# Altium schematic sheet ADC.SchDoc
size A4
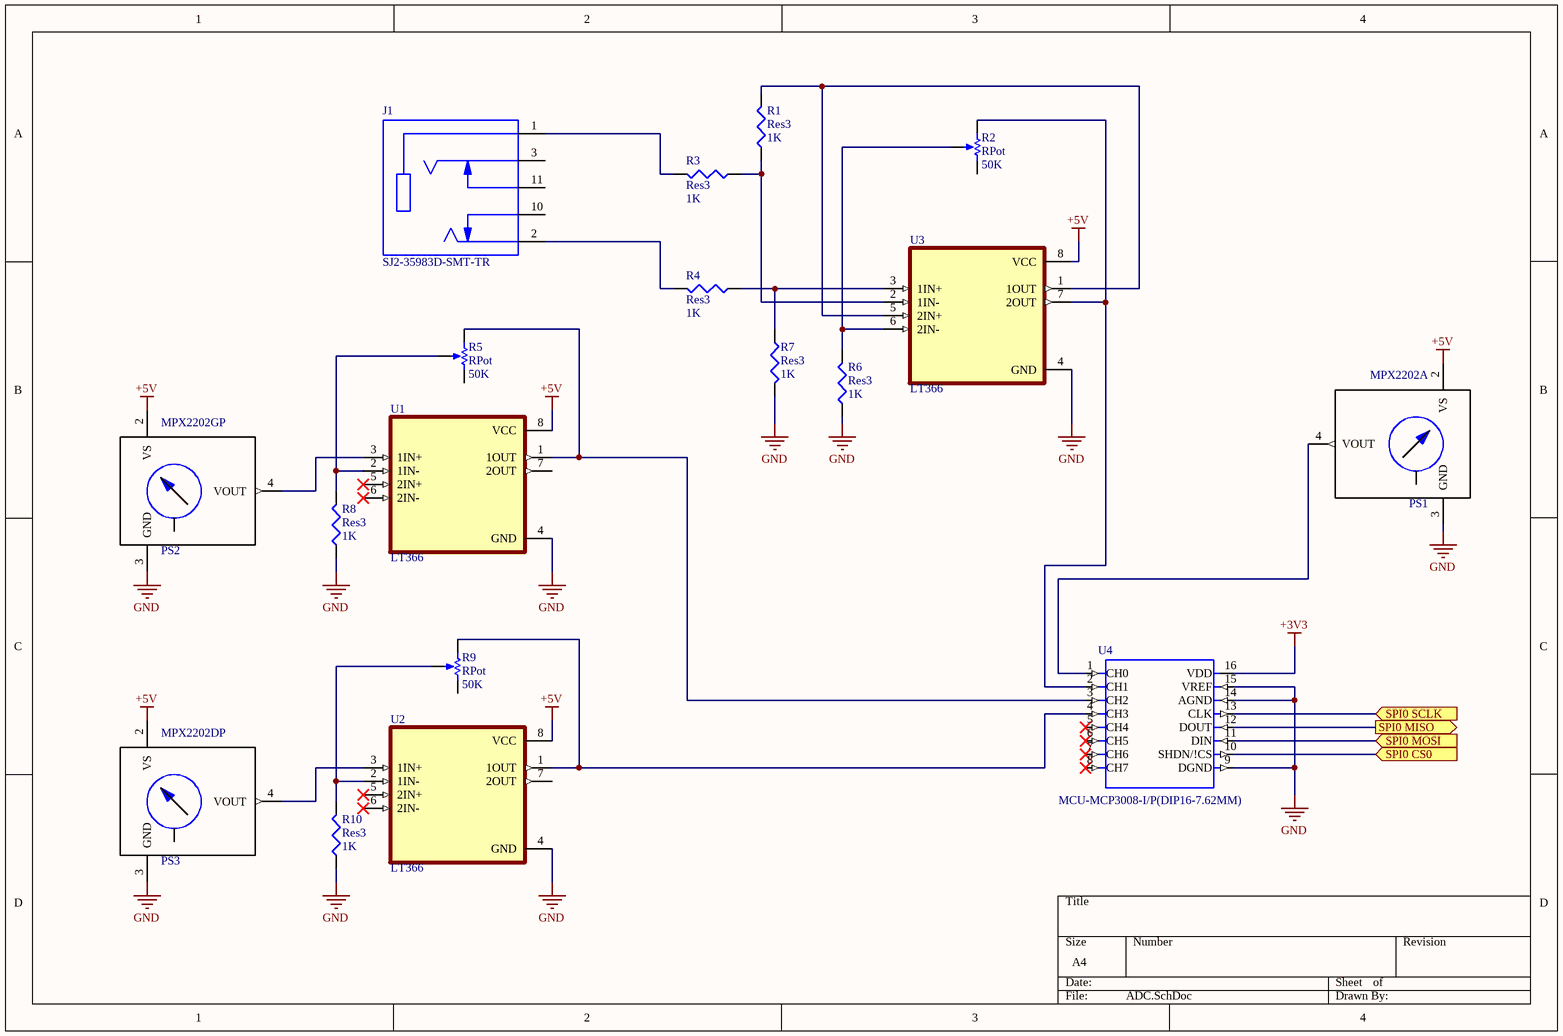
[diagram p0: ADC.SchDoc]

## Parts
J1  SJ2-35983D-SMT-TR  [CUI_SJ2-35983D-SMT-TR]
PS1  MPX2202A  [*867-V]
PS2  MPX2202GP  [*867B-V]
PS3  MPX2202DP  [*867C-V]
R1  Res3  value 1K  [J1-0603]
R2  RPot  value 50K  [VR5]
R3  Res3  value 1K  [J1-0603]
R4  Res3  value 1K  [J1-0603]
R5  RPot  value 50K  [VR5]
R6  Res3  value 1K  [J1-0603]
R7  Res3  value 1K  [J1-0603]
R8  Res3  value 1K  [J1-0603]
R9  RPot  value 50K  [VR5]
R10  Res3  value 1K  [J1-0603]
U1  LT366  [DIP-8]
U2  LT366  [DIP-8]
U3  LT366  [DIP-8]
U4  MCU-MCP3008-I/P(DIP16-7.62MM)  [DIP16-2.54-19.2X7.62MM]

## Ports
SPI0 CS0 (in), SPI0 MISO (out), SPI0 MOSI (in), SPI0 SCLK (in)

## Nets
+3V3: U4.16(VDD)
+5V: PS1.2(VS) PS2.2(VS) PS3.2(VS) U1.8(VCC) U2.8(VCC) U3.8(VCC)
GND: PS1.3(GND) PS2.3(GND) PS3.3(GND) R6.1 R7.2 R8.1 R10.1 U1.4(GND) U2.4(GND) U3.4(GND) U4.9(DGND) U4.14(AGND) U4.15(VREF)
SPI0 CS0: U4.10(SHDN/!CS) ; port SPI0 CS0
SPI0 MISO: U4.12(DOUT) ; port SPI0 MISO
SPI0 MOSI: U4.11(DIN) ; port SPI0 MOSI
SPI0 SCLK: U4.13(CLK) ; port SPI0 SCLK
NetJ1_1: J1.1(SLEEVE) R3.2
NetJ1_2: J1.2(TIP) R4.2
NetPS1_4: PS1.4(VOUT) U4.1(CH0)
NetPS2_4: PS2.4(VOUT) U1.3(1IN+)
NetPS3_4: PS3.4(VOUT) U2.3(1IN+)
NetR1_1: R1.1 R3.1 U3.2(1IN-)
NetR1_2: R1.2 U3.1(1OUT) U3.5(2IN+)
NetR2_1: R2.1(TOP) U3.7(2OUT) U4.2(CH1)
NetR2_3: R2.3(TAP) R6.2 U3.6(2IN-)
NetR4_1: R4.1 R7.1 U3.3(1IN+)
NetR5_1: R5.1(TOP) U1.1(1OUT) U4.3(CH2)
NetR5_3: R5.3(TAP) R8.2 U1.2(1IN-)
NetR9_1: R9.1(TOP) U2.1(1OUT) U4.4(CH3)
NetR9_3: R9.3(TAP) R10.2 U2.2(1IN-)

Not connected (* = marked no-connect by the designer): J1 3(RING1) 10(TIP_SWITCH) 11(RING1_SWITCH); PS1 1(NC@1) 5(NC@5) 6(NC@6); PS2 1(NC@1) 5(NC@5) 6(NC@6); PS3 1(NC@1) 5(NC@5) 6(NC@6); R2 2(BOT); R5 2(BOT); R9 2(BOT); U1 5(2IN+)* 6(2IN-)* 7(2OUT); U2 5(2IN+)* 6(2IN-)* 7(2OUT); U4 5(CH4)* 6(CH5)* 7(CH6)* 8(CH7)*

## Library data of the parts
J1 = SJ2-35983D-SMT-TR: 3 conductor, 3.5 mm, SMT Audio Jack w/ 2 switch; Package: None; Price: None; Value: *; MP: SJ2-35983D-SMT-TR; Availability: Unavailable
PS1-PS3 = MPX*****: Low-Side Gate Driver IC Inverting, Non-Inverting 6-MLP (2x2); MP: MPX; MF: ON Semiconductor; Package: SOT-223-4 Texas Instruments; Availability: Bad; Check_prices: https://www.snapeda.com/parts/MPX/ON%20Semiconductor/view-part/121742/?ref=eda; SnapEDA_Link: https://www.snapeda.com/parts/MPX/ON%20Semiconductor/view-part/121742/?ref=snap; Price: None; Value: *
R1 R3 R4 R6-R8 R10 = Res3: Resistor; Published: 8-Jun-2000; LatestRevisionDate: 29-May-2009; LatestRevisionNote: IPC-7351 Footprint Added.; PackageReference: J1-0603; Publisher: Altium Limited; PackageDescription: Chip Resistor
R2 R5 R9 = RPot: Potentiometer; Sim Note: Enter the Resistance value and the set point into parameter fields.; Set Position: 0.5; Published: 8-Jun-2000; LatestRevisionDate: 17-Jul-2002; LatestRevisionNote: Re-released for DXP Platform.; PackageReference: VR5; Publisher: Altium Limited; PackageDescription: Variable Resistor, Thru-Hole; 3 Leads
U1-U3 = LM358P: Dual Operational Amplifiers; MF: Texas Instruments; Package: PDIP-8 Texas Instruments; DigiKey-Purchase-URL: https://snapeda.com/shop?store=DigiKey&id=559457; MP: LM358P; Arrow_Electronics-Purchase-URL: https://snapeda.com/shop?store=Arrow+Electronics&id=559457; Price: None; Texas_Instruments-Purchase-URL: https://snapeda.com/shop?store=Texas+Instruments&id=559457; Value: *; Availability: Unavailable; SnapEDA_Link: https://www.snapeda.com/parts/LM358P/Texas%20Instruments/view-part/559457/?ref=snap; Mouser-Purchase-URL: https://snapeda.com/shop?store=Mouser&id=559457
U4 = MCU-MCP3008-I/P(DIP16-7.62MM): 10 Bit Analog to Digital Converter 4, 8 Input 1 SAR 16-PDIP; MF: Microchip; Package: DIP-16 Microchip; Value: *; Availability: Unavailable; SnapEDA_Link: https://www.snapeda.com/parts/MCP3008-I/P/Microchip/view-part/43628/?ref=snap; Price: None; MP: MCP3008-I/P